# EAGLE design FINAL_1_BLUETOOTH12 (EAGLE 6.5.0)
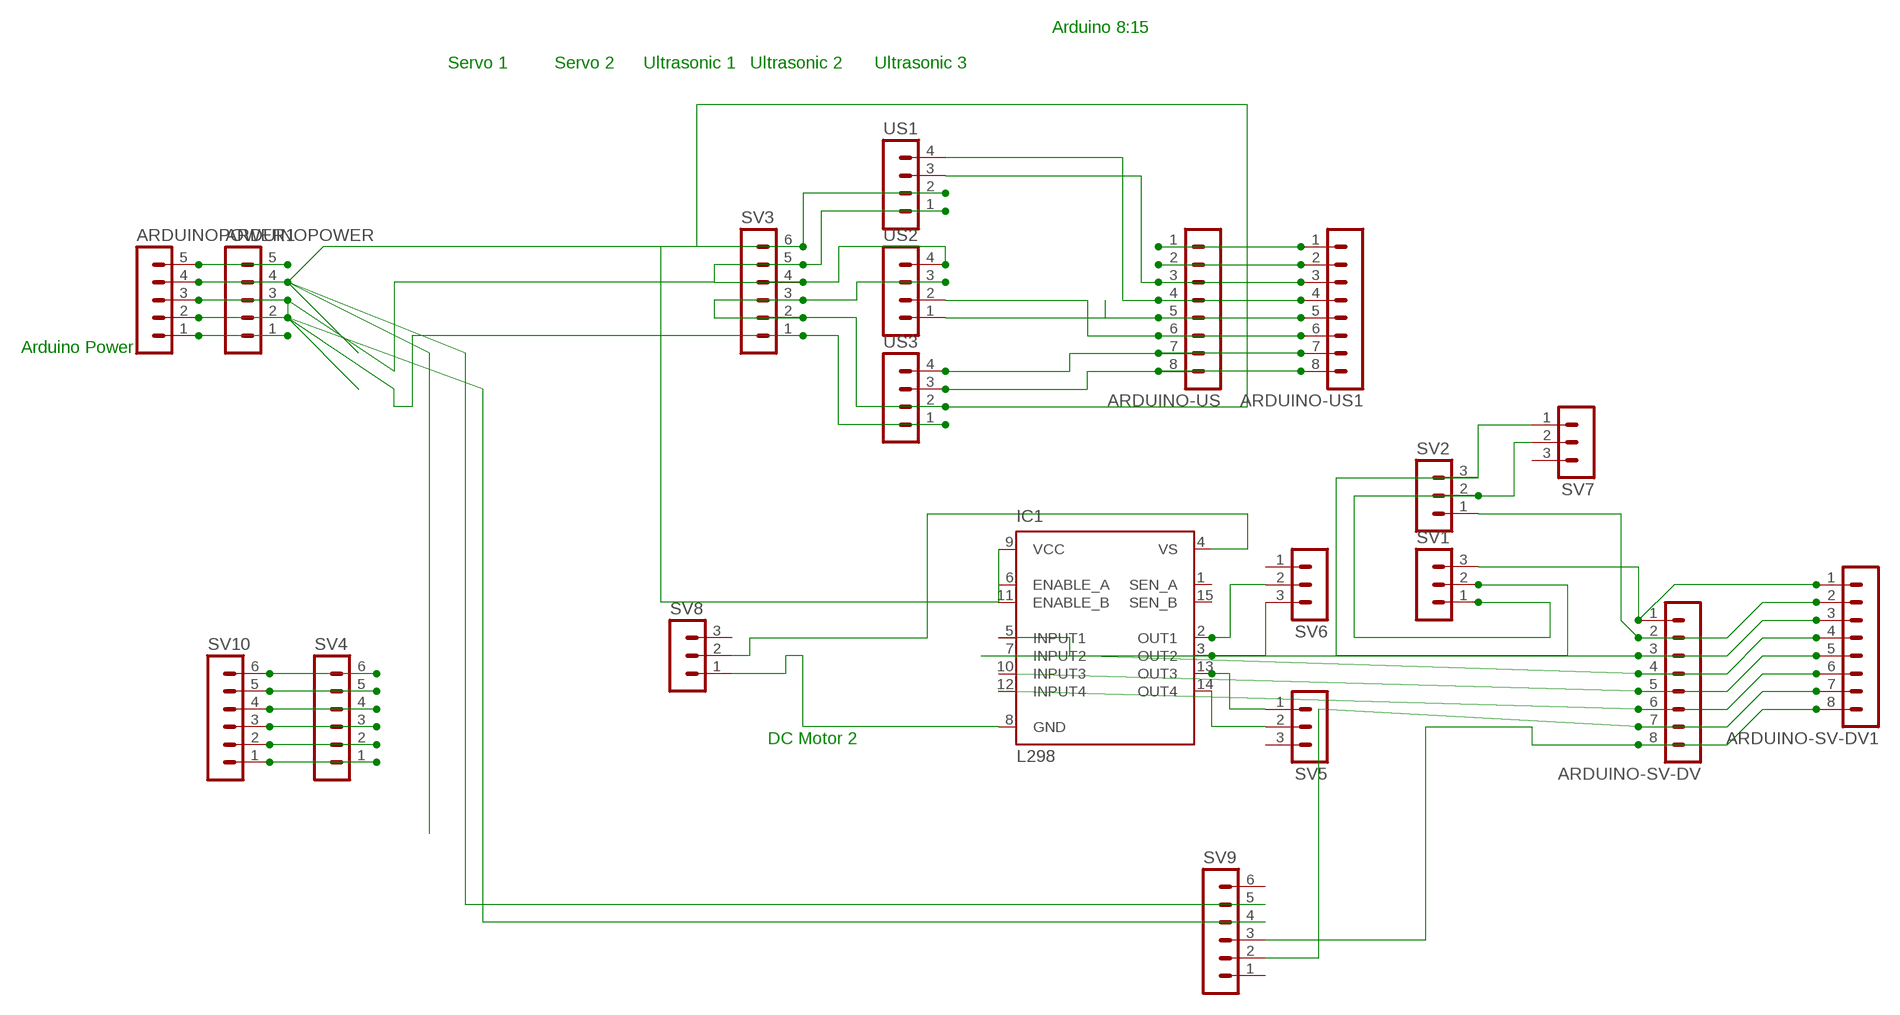
[diagram p0: schematic, sheet 1]

## Parts
ARDUINO-SV-DV  MA08-1W  [MA08-1W]
ARDUINO-SV-DV1  MA08-1W  [MA08-1W]
ARDUINO-US  MA08-1W  [MA08-1W]
ARDUINO-US1  MA08-1W  [MA08-1W]
ARDUINOPOWER  MA05-1  [MA05-1]
ARDUINOPOWER1  MA05-1  [MA05-1]
IC1  L298  [MULTIWATT-15]
SV1  MA03-1  [MA03-1]
SV2  MA03-1  [MA03-1]
SV3  MA06-1  [MA06-1]
SV4  MA06-1  [MA06-1]
SV5  MA03-1  [MA03-1]
SV6  MA03-1  [MA03-1]
SV7  MA03-1  [MA03-1]
SV8  MA03-1  [MA03-1]
SV9  MA06-1  [MA06-1]
SV10  MA06-1  [MA06-1]
US1  MA04-1  [MA04-1]
US2  MA04-1  [MA04-1]
US3  MA04-1  [MA04-1]

## Nets
5V2: SV1.2 SV2.3 SV7.1
5VSS: ARDUINOPOWER1.4 ARDUINOPOWER.4 IC1.6(ENABLE_A) IC1.9(VCC) IC1.11(ENABLE_B) SV3.2 SV3.3 SV3.6 SV9.5 US1.2 US2.3 US3.2
GND2: ARDUINOPOWER1.2 ARDUINOPOWER1.3 ARDUINOPOWER.2 ARDUINOPOWER.3 SV3.1 SV3.4 SV3.5 SV9.4 US1.1 US2.4 US3.1
N$1: ARDUINO-SV-DV1.8 ARDUINO-SV-DV.8 SV9.3
N$2: ARDUINO-SV-DV1.7 ARDUINO-SV-DV.7 SV9.2
N$3: IC1.2(OUT1) SV6.2
N$4: IC1.8(GND) SV8.1
N$5: IC1.4(VS) SV8.2
N$6: IC1.3(OUT2) SV6.3
N$7: IC1.13(OUT3) SV5.1
N$8: IC1.14(OUT4) SV5.2
N$9: ARDUINO-US1.2 ARDUINO-US.2
N$10: ARDUINO-SV-DV1.4 ARDUINO-SV-DV.4 IC1.5(INPUT1)
N$11: ARDUINO-SV-DV1.3 ARDUINO-SV-DV.3 IC1.7(INPUT2)
N$12: ARDUINO-SV-DV1.5 ARDUINO-SV-DV.5 IC1.10(INPUT3)
N$13: ARDUINO-SV-DV1.2 ARDUINO-SV-DV.2 SV2.1
N$24: SV1.1 SV2.2 SV7.2
N$33: ARDUINO-US1.1 ARDUINO-US.1
N$38: ARDUINOPOWER1.5 ARDUINOPOWER.5
N$44: SV4.6 SV10.6
N$45: SV4.4 SV10.4
N$46: SV4.5 SV10.5
N$47: SV4.3 SV10.3
N$48: SV4.2 SV10.2
N$49: SV4.1 SV10.1
N$57: ARDUINO-SV-DV1.1 ARDUINO-SV-DV.1 SV1.3
N$58: ARDUINOPOWER1.1 ARDUINOPOWER.1
SGN6: ARDUINO-SV-DV1.6 ARDUINO-SV-DV.6 IC1.12(INPUT4)
US1: ARDUINO-US1.3 ARDUINO-US.3 US1.3
US2: ARDUINO-US1.4 ARDUINO-US.4 US1.4
US3: ARDUINO-US1.5 ARDUINO-US.5 US2.1
US4: ARDUINO-US1.6 ARDUINO-US.6 US2.2
US5: ARDUINO-US1.7 ARDUINO-US.7 US3.4
US6: ARDUINO-US1.8 ARDUINO-US.8 US3.3
Unconnected: IC1.1(SEN_A) IC1.15(SEN_B) SV5.3 SV6.1 SV7.3 SV8.3 SV9.1 SV9.6

## Notes on the sheet
- Arduino 8:15
- Servo 1 | Servo 2 | Ultrasonic 1 | Ultrasonic 2 | Ultrasonic 3
- Arduino Power
- DC Motor 2

## Library data of the parts
ARDUINO-SV-DV ARDUINO-SV-DV1 ARDUINO-US ARDUINO-US1 = con-lstb:MA08-1W: PIN HEADER; OC_FARNELL: unknown; OC_NEWARK: unknown
ARDUINOPOWER ARDUINOPOWER1 = con-lstb:MA05-1: PIN HEADER; OC_FARNELL: unknown; OC_NEWARK: unknown
IC1 = st-microelectronics:L298: DUAL FULL-BRIDGE DRIVER; MPN: L298N; OC_FARNELL: 1589425; OC_NEWARK: 32M1527
SV1 SV2 SV5-SV8 = con-lstb:MA03-1: PIN HEADER; OC_FARNELL: unknown; OC_NEWARK: unknown
SV3 SV4 SV9 SV10 = con-lstb:MA06-1: PIN HEADER; OC_FARNELL: unknown; OC_NEWARK: unknown
US1-US3 = con-lstb:MA04-1: PIN HEADER; OC_FARNELL: unknown; OC_NEWARK: unknown

## Net classes
0 default: clearance 0.205 mm

## Board
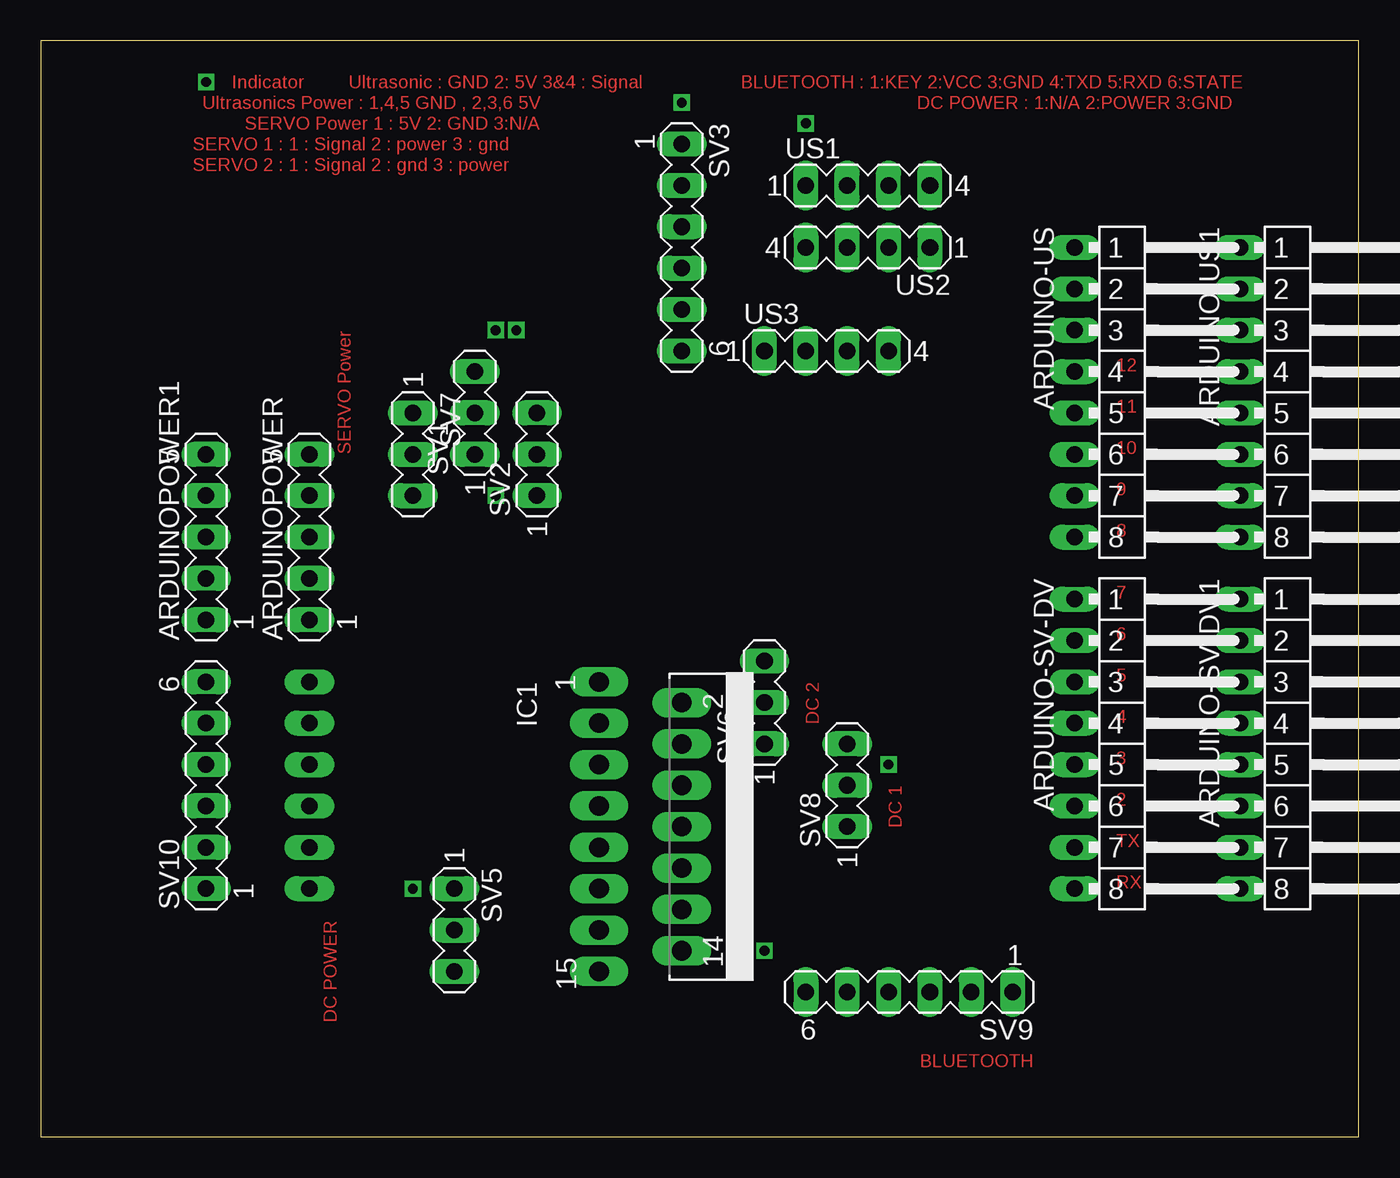
[diagram p1: board, top side]
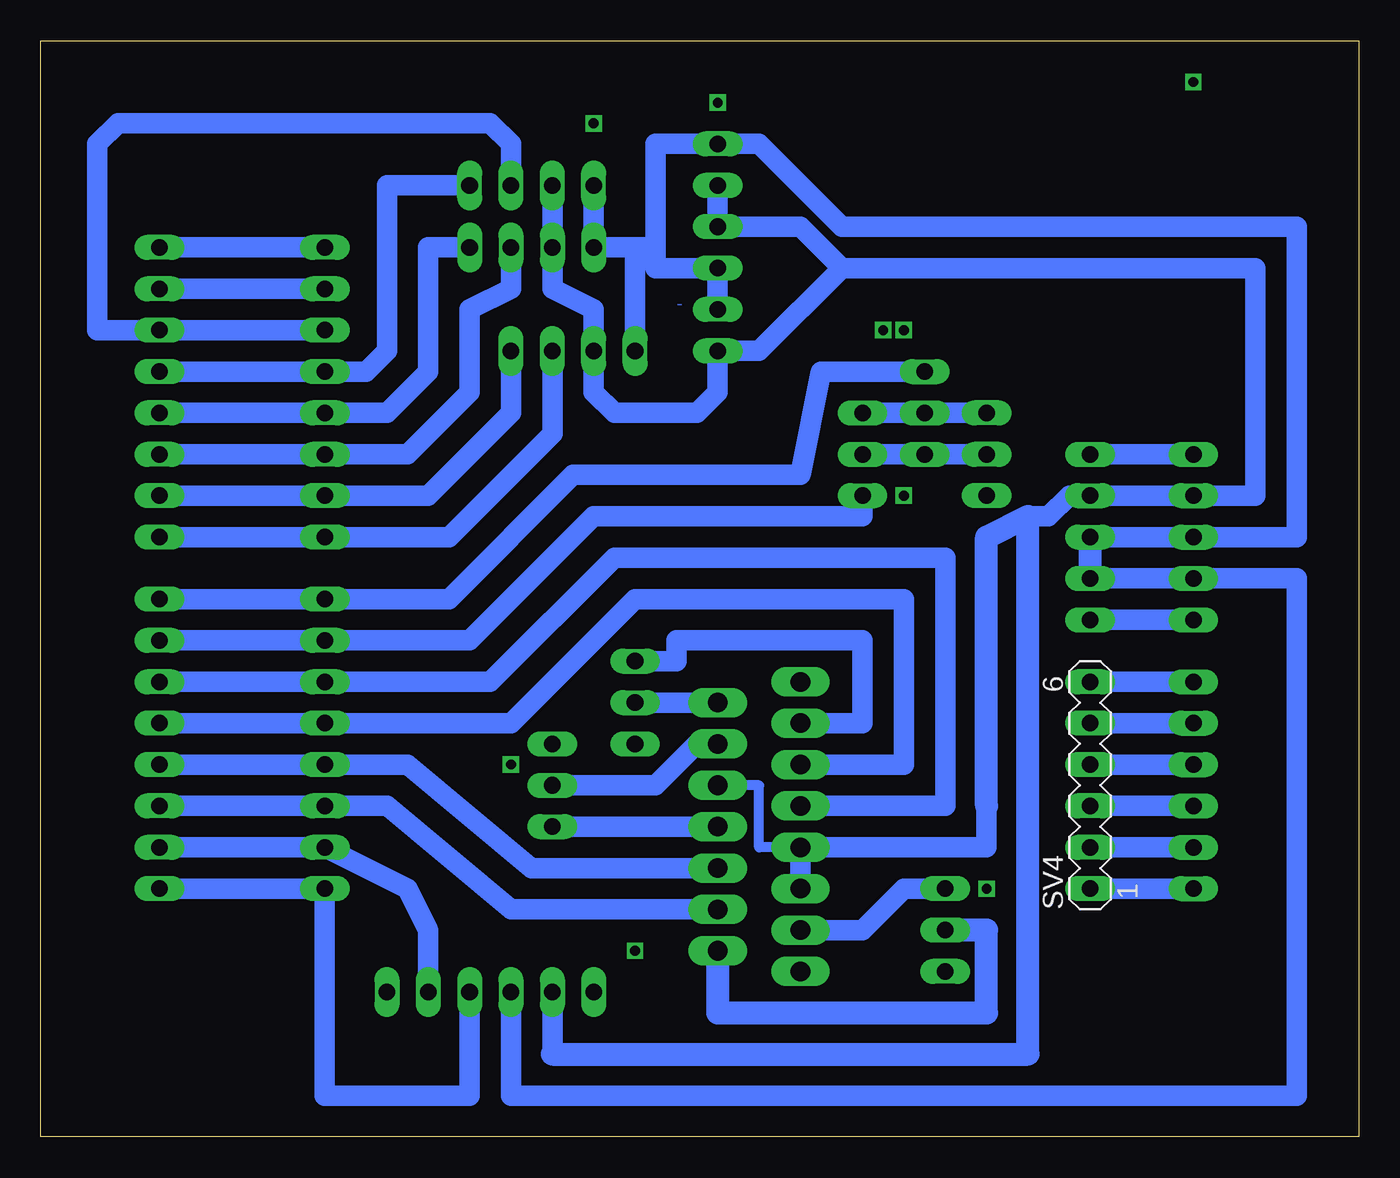
[diagram p2: board, bottom side, seen from below]

Size 80.95 x 67.3 mm. Coordinates in mm from the lower left corner, seen from the top.
Outline: 0,0 80.95,0 80.95,67.3 0,67.3 0,0
Copper layers (1*16): Top 0.035mm / dielectric 1.5mm / Bottom 0.035mm
Design rules "default": minimum track width 10mil, minimum drill 24mil, track to track 8mil, track to pad 8mil, pad to pad 8mil, via to via 8mil, smd to smd 8mil, copper to edge 40mil, drill to drill 8mil, minimum pad ring 10mil, minimum via ring 8mil, stop-mask expansion 4mil, vias tented up to drill 0mil, thermal gap 10mil

### Footprints (pad centres in the part's own frame; a part is rotated, then mirrored left to right if it is on the bottom)
MA08-1W = drill 1.016 long: 1 -8.89,0; 2 -6.35,0; 3 -3.81,0; 4 -1.27,0; 5 1.27,0; 6 3.81,0; 7 6.35,0; 8 8.89,0
MA05-1 = drill 1.016 long: 1 -5.08,0; 2 -2.54,0; 3 0,0; 4 2.54,0; 5 5.08,0
MULTIWATT-15 = drill 1.2 long: 1 -8.89,-7.62; 2 -7.62,-2.54; 3 -6.35,-7.62; 4 -5.08,-2.54; 5 -3.81,-7.62; 6 -2.54,-2.54; 7 -1.27,-7.62; 8 0,-2.54; 9 1.27,-7.62; 10 2.54,-2.54; 11 3.81,-7.62; 12 5.08,-2.54; 13 6.35,-7.62; 14 7.62,-2.54; 15 8.89,-7.62
MA03-1 = drill 1.016 long: 1 -2.54,0; 2 0,0; 3 2.54,0
MA06-1 = drill 1.016 long: 1 -6.35,0; 2 -3.81,0; 3 -1.27,0; 4 1.27,0; 5 3.81,0; 6 6.35,0
MA04-1 = drill 1.016 long: 1 -3.81,0; 2 -1.27,0; 3 1.27,0; 4 3.81,0

### Placement (x,y rotation side)
ARDUINO-SV-DV  63.5,24.13 270 top
ARDUINO-SV-DV1  73.66,24.13 270 top
ARDUINO-US  63.5,45.72 270 top
ARDUINO-US1  73.66,45.72 270 top
ARDUINOPOWER  16.51,36.83 90 top
ARDUINOPOWER1  10.16,36.83 90 top
IC1  41.91,19.05 270 top
SV1  26.67,44.45 90 top
SV2  30.48,41.91 90 top
SV3  39.37,54.61 270 top
SV4  16.51,21.59 90 bottom
SV5  25.4,12.7 270 top
SV6  44.45,26.67 90 top
SV7  22.86,41.91 270 top
SV8  49.53,21.59 90 top
SV9  53.34,8.89 180 top
SV10  10.16,21.59 90 top
US1  50.8,58.42 0 top
US2  50.8,54.61 180 top
US3  48.26,48.26 0 top

### Tracks (layer width: path | path; a pad name or v marks a point on that pad's centre or on a via)
5V2
  Bottom 1.27: SV2.3 SV1.2 SV7.1
5VSS
  Bottom 0.61: IC1.9 36.83,17.78 36.83,21.59 IC1.6
  Bottom 1.27: US1.2 US2.3 49.53,52.07 46.99,50.8 US3.2 46.99,45.72 45.72,44.45 40.64,44.45 39.37,45.72 SV3.6 36.83,48.26 31.75,53.34 | SV3.2 SV3.3 34.29,55.88 31.75,53.34 | IC1.11 IC1.9 22.86,17.78 22.86,20.32 | 20.32,38.1 19.05,38.1 17.78,39.37 ARDUINOPOWER.4 ARDUINOPOWER1.4 6.35,39.37 6.35,53.34 31.75,53.34 | 49.53,5.08 SV9.5
  Bottom 1.422: 22.86,20.32 22.86,36.83 20.32,38.1 20.32,5.08 49.53,5.08
GND2
  Bottom 1.27: SV9.4 52.07,2.54 3.81,2.54 3.81,34.29 ARDUINOPOWER1.2 ARDUINOPOWER.2 | US1.1 US2.4 44.45,54.61 | 43.18,54.61 43.18,60.96 SV3.1 36.83,60.96 31.75,55.88 3.81,55.88 3.81,36.83 ARDUINOPOWER1.3 ARDUINOPOWER.3 | 43.18,54.61 43.18,53.34 SV3.4 SV3.5 | 44.45,54.61 43.18,54.61 | US3.1 44.45,54.61
  Bottom 1.422: ARDUINOPOWER.3 ARDUINOPOWER.2
N$1
  Bottom 1.27: SV9.3 54.61,2.54 63.5,2.54 ARDUINO-SV-DV.8 ARDUINO-SV-DV1.8
N$2
  Bottom 1.27: ARDUINO-SV-DV.7 62.48,17.27 | 62.48,17.27 58.42,15.24 57.15,12.7 SV9.2 | ARDUINO-SV-DV1.7 62.99,17.78 62.48,17.27
N$3
  Bottom 1.27: SV6.2 IC1.2
N$4
  Bottom 1.27: SV8.1 IC1.8
N$5
  Bottom 1.27: SV8.2 43.18,21.59 40.64,24.13 IC1.4
N$6
  Bottom 1.27: SV6.3 41.91,29.21 41.91,30.48 30.48,30.48 30.48,25.4 IC1.3
N$7
  Bottom 1.27: SV5.1 27.94,15.24 30.48,12.7 IC1.13
N$8
  Bottom 1.422: IC1.14 39.37,7.62 22.86,7.62 22.86,12.7 SV5.2
N$9
  Bottom 1.27: ARDUINO-US1.2 ARDUINO-US.2
N$10
  Bottom 1.27: IC1.5 27.94,22.86 27.94,33.02 44.45,33.02 52.07,25.4 ARDUINO-SV-DV.4 ARDUINO-SV-DV1.4
N$11
  Bottom 1.27: IC1.7 25.4,20.32 25.4,35.56 45.72,35.56 53.34,27.94 ARDUINO-SV-DV.3 ARDUINO-SV-DV1.3
N$12
  Bottom 1.27: IC1.10 50.8,16.51 58.42,22.86 ARDUINO-SV-DV.5 ARDUINO-SV-DV1.5
N$13
  Bottom 1.27: SV2.1 30.48,38.1 46.99,38.1 54.61,30.48 ARDUINO-SV-DV.2 ARDUINO-SV-DV1.2
N$14  (via drill 0.6)
  other vias: 44.45,11.43
N$15  (via drill 0.6)
  other vias: 52.07,22.86
N$17  (via drill 0.6)
  other vias: 27.94,49.53
N$18  (via drill 0.6)
  other vias: 29.21,49.53
N$19  (via drill 0.6)
  other vias: 27.94,39.37
N$20  (via drill 0.6)
  other vias: 46.99,62.23
N$21  (via drill 0.6)
  other vias: 22.86,15.24
N$22  (via drill 0.6)
  other vias: 39.37,63.5
N$23  (via drill 0.6)
  other vias: 10.16,64.77
N$24
  Bottom 1.27: SV7.2 SV1.1 SV2.2
N$33
  Bottom 1.27: ARDUINO-US1.1 ARDUINO-US.1
N$38
  Bottom 1.27: ARDUINOPOWER1.5 ARDUINOPOWER.5
N$44
  Bottom 1.27: SV10.6 SV4.6
N$45
  Bottom 1.27: SV4.4 SV10.4
N$46
  Bottom 1.27: SV4.5 SV10.5
N$47
  Bottom 1.27: SV4.3 SV10.3
N$48
  Bottom 1.27: SV4.2 SV10.2
N$49
  Bottom 1.27: SV4.1 SV10.1
N$57
  Bottom 1.27: SV1.3 33.02,46.99 34.29,40.64 48.26,40.64 55.88,33.02 62.23,33.02 ARDUINO-SV-DV.1 ARDUINO-SV-DV1.1
N$58
  Bottom 1.27: ARDUINOPOWER1.1 ARDUINOPOWER.1
SGN6
  Bottom 1.27: IC1.12 52.07,13.97 59.69,20.32 ARDUINO-SV-DV.6 ARDUINO-SV-DV1.6
US1
  Bottom 1.27: ARDUINO-US.3 ARDUINO-US1.3 77.47,49.53 77.47,60.96 76.2,62.23 53.34,62.23 52.07,60.96 US1.3
US2
  Bottom 1.27: US1.4 59.69,58.42 59.69,48.26 60.96,46.99 ARDUINO-US.4 ARDUINO-US1.4
US3
  Bottom 1.27: US2.1 57.15,54.61 57.15,46.99 59.69,44.45 ARDUINO-US.5 ARDUINO-US1.5
US4
  Bottom 1.27: US2.2 52.07,52.07 54.61,50.8 54.61,45.72 58.42,41.91 ARDUINO-US.6 ARDUINO-US1.6
US5
  Bottom 1.27: US3.4 52.07,44.45 57.15,39.37 ARDUINO-US.7 ARDUINO-US1.7
US6
  Bottom 1.27: US3.3 49.53,43.18 55.88,36.83 ARDUINO-US.8 ARDUINO-US1.8

### Text on the board
Top: Indicator | Ultrasonic : GND 2: 5V 3&4 : Signal | BLUETOOTH : 1:KEY 2:VCC 3:GND 4:TXD 5:RXD 6:STATE | Ultrasonics Power : 1,4,5 GND , 2,3,6 5V | DC POWER : 1:N/A 2:POWER 3:GND | SERVO Power 1 : 5V 2: GND 3:N/A | SERVO 1 : 1 : Signal 2 : power 3 : gnd | SERVO 2 : 1 : Signal 2 : gnd 3 : power | 12 | 11 | SERVO Power | 10 | 9 | 8 | 7 | 6 | DC 2 | 5 | 4 | 3 | DC 1 | 2 | TX | RX | DC POWER | BLUETOOTH
Bottom: -
bTest: F L O W S H I E L D | F L O W S H I E L D
bDocu: F L O W S H I E L D